# EAGLE design mk6 (EAGLE 8.3.0)
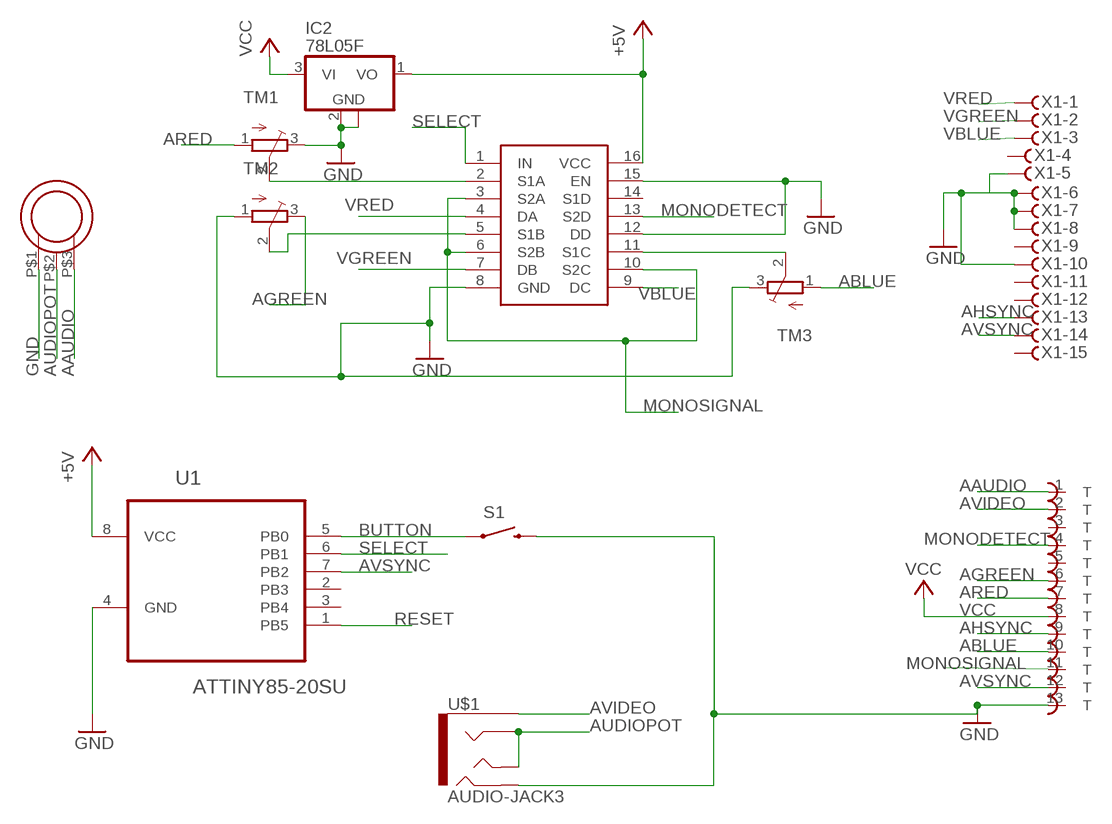
[diagram p0: schematic, sheet 1]

## Parts
ATARIOUT  DIN13T  [ADADS]
IC2  78L05F  [SOT89]
S1  SWITCH-MOMENTARY-2TACTILE-SWITCH-SMD-RIGHT-ANGLE  [TACTILE_SWITCH-SMD-RIGHT-ANGLE]
TM1  TRIMPOTTC33X  [TC33X]
TM2  TRIMPOTTC33X  [TC33X]
TM3  TRIMPOTTC33X  [TC33X]
TS5V330  V330  [SOIC16N]
U1  ATTINY85-20SU  [SOIC127P798X216-8N]
U$1  AUDIO-JACK3  [AUDIO-JACK-TRRS-SMD]
U$2  DB-1001N  [THUMB_POT]
X1  F15HDVS  [HDF15V]

## Nets
+5V: IC2.1(VO) TS5V330.16(VCC) U1.8(VCC)
AAUDIO: ATARIOUT.1 U$2.P$3
ABLUE: ATARIOUT.10 TM3.1(A)
AGREEN: ATARIOUT.6 TM2.3(E)
AHSYNC: ATARIOUT.9 X1.13
ARED: ATARIOUT.7 TM1.1(A)
AUDIOPOT: U$1.RING1 U$1.TIP U$2.P$2
AVIDEO: ATARIOUT.2 U$1.EARTH
AVSYNC: ATARIOUT.12 U1.7(PB2) X1.14
BUTTON: S1.1 U1.5(PB0)
GND: ATARIOUT.13 IC2.2(GND) IC2.2@1(GND) S1.2 TM1.3(E) TM2.1(A) TM3.3(E) TS5V330.8(GND) TS5V330.12(DD) TS5V330.15(EN) U1.4(GND) U$1.RING2 U$2.P$1 X1.5 X1.6 X1.7 X1.8 X1.10
MONODETECT: ATARIOUT.4 TS5V330.13(S2D)
MONOSIGNAL: ATARIOUT.11 TS5V330.3(S2A) TS5V330.6(S2B) TS5V330.10(S2C)
N$1: TM1.2(S) TS5V330.2(S1A)
N$3: TM2.2(S) TS5V330.5(S1B)
N$5: TM3.2(S) TS5V330.11(S1C)
RESET: U1.1(PB5)
SELECT: TS5V330.1(IN) U1.6(PB1)
VBLUE: TS5V330.9(DC) X1.3
VCC: ATARIOUT.8 IC2.3(VI)
VGREEN: TS5V330.7(DB) X1.2
VRED: TS5V330.4(DA) X1.1
Unconnected: ATARIOUT.3 ATARIOUT.5 TS5V330.14(S1D) U1.2(PB3) U1.3(PB4) X1.4 X1.9 X1.11 X1.12 X1.15

## Library data of the parts
ATARIOUT = ube:DIN13
IC2 = linear:78L*: POSITOIV-VOLTAGE REGULATORS Output up to 100 mA Source: Datasheet <http://focus.ti.com/lit/ds/symlink/ua78l05.pdf>
S1 = SparkFun-Electromechanical:SWITCH-MOMENTARY-2: Various NO switches- pushbuttons, reed, etc; PROD_ID: COMP-12265
TM1-TM3 = adafruit:TRIMPOT: SMT trimmer potentiometer part number TC33X http://www.ladyada.net/library/eagle
TS5V330 = ube:V330
U1 = Atmel_By_element14_Batch_1-00:ATTINY85-20SU: 8-bit Microcontroller with In-System Programmable Flash; MPN: ATTINY85-20SU; OC_FARNELL: 1455164; OC_NEWARK: 58M3797; PACKAGE: SOIC-8; SUPPLIER: Atmel
U$1 = SparkFun-Connectors:AUDIO-JACK3: Audio jack - 3.5mm TRRS variety - two rings.; PROD_ID: CONN-10676
U$2 = irbanur_rev1:DB-1001N: Multicomp DB-1001N thumbwheel potentiometer Source: DB Datasheet <http://www.debonelectronics.com/sale-7784350-db-1001n-thumbwheel-potentiometer.html> created by: mochini@2017 <https://www.fiverr.com/mochini77>
X1 = con-subd:F15?S: SUB-D; OC_FARNELL: unknown; OC_NEWARK: unknown

## Net classes
0 default: width 0.254 mm

## Board
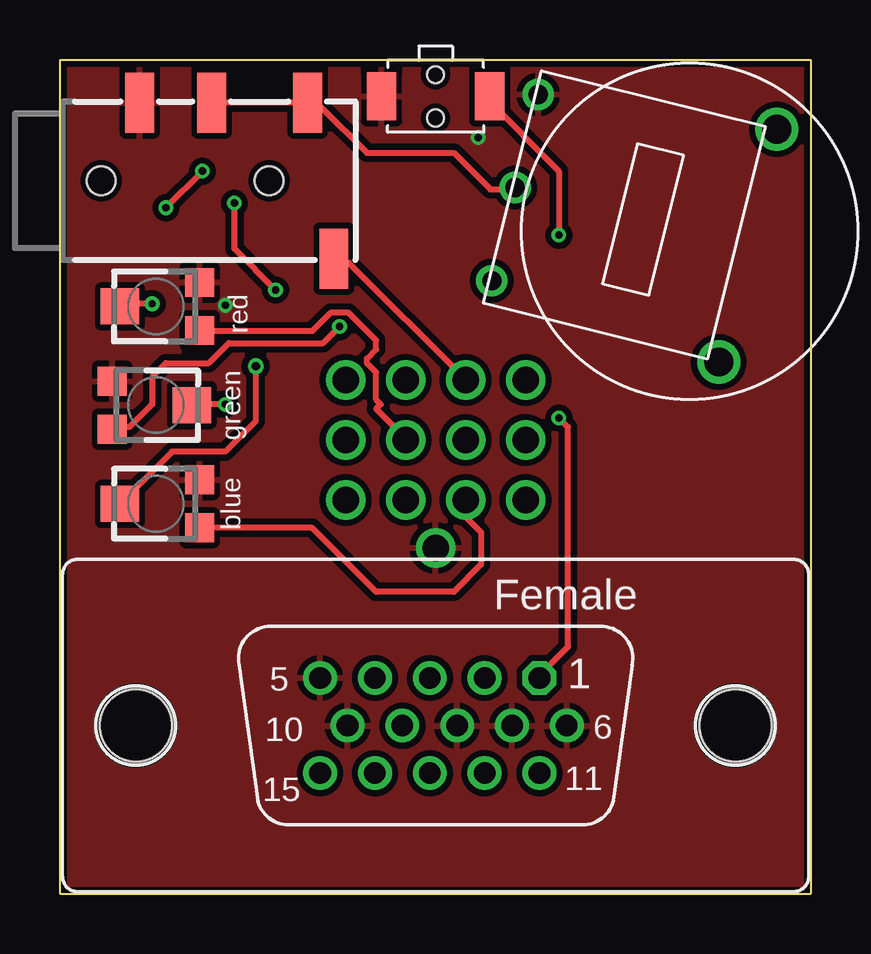
[diagram p1: board, top side]
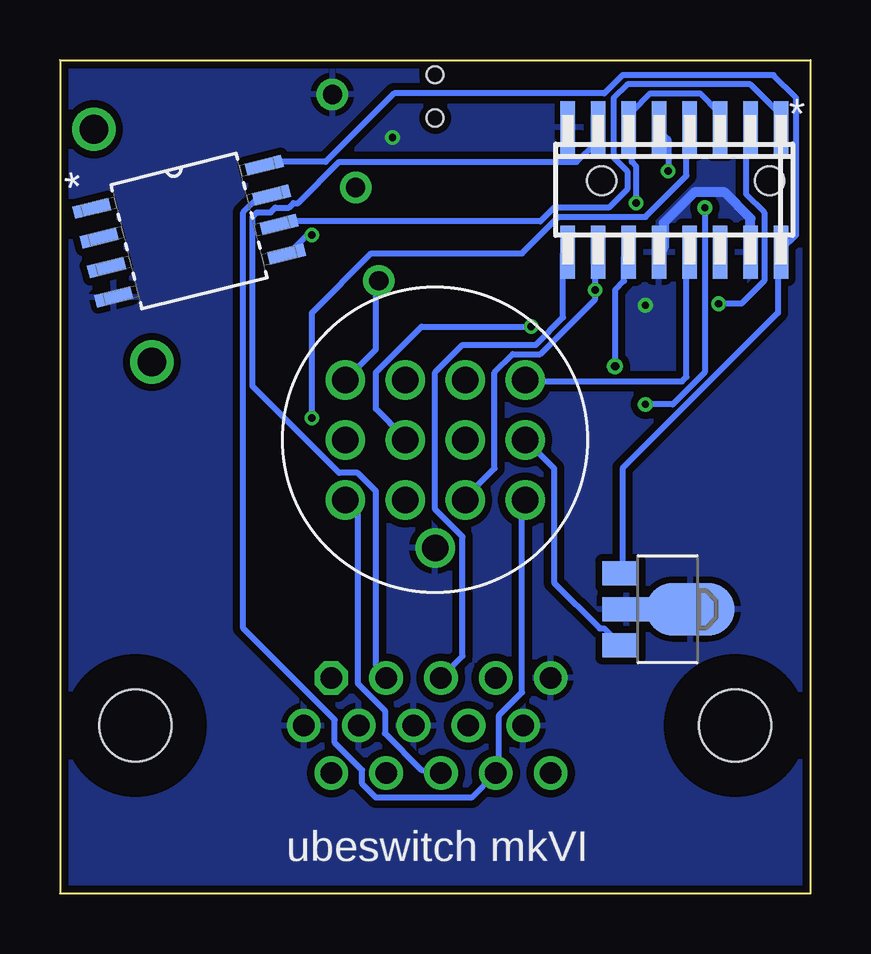
[diagram p2: board, bottom side, seen from below]

Size 31.3 x 34.73 mm. Coordinates in mm from the lower left corner, seen from the top.
Outline: 0,0 31.3,0 31.3,34.73 0,34.73 0,0
Copper layers (1*16): Top 0.035mm / dielectric 1.5mm / Bottom 0.035mm
Design rules "dirt_cheap_dirty_boards.v1": minimum track width 5mil, minimum drill 12mil, track to track 5mil, track to pad 5mil, pad to pad 5mil, via to via 5mil, smd to smd 0mil, copper to edge 10mil, drill to drill 10mil, minimum pad ring 10mil, minimum via ring 6mil, stop-mask expansion 2mil, vias tented up to drill 25mil, thermal gap 10mil

### Footprints (pad centres in the part's own frame; a part is rotated, then mirrored left to right if it is on the bottom)
ADADS = drill 1.1: 1 -3.75,2.5; 2 -1.25,2.5; 3 1.25,2.5; 4 3.75,2.5; 5 -3.75,0; 6 -1.25,0; 7 1.25,0; 8 3.75,0; 9 -3.75,-2.5; 10 -1.25,-2.5; 11 1.25,-2.5; 12 3.75,-2.5; 13 0,-4.5
SOT89 = smd 1 x 1.5: 1 -1.499,-1.981; 3 1.499,-1.981 | smd 1 x 2: 2 0,-1.727 | smd 2.2 x 3.7: 2@1 0,0.94
TACTILE_SWITCH-SMD-RIGHT-ANGLE = smd 1.219 x 2: 1 -2.255,0; 2 2.255,0 | hole 0.7: 0,0.9; 0,-0.9
TC33X = smd 1.2 x 1.2: 1 -1,-1.825; 3 1,-1.825 | smd 1.5 x 1.6: 2 0,1.5
SOIC16N = smd 0.6 x 2.2: 1 -4.445,-2.6; 2 -3.175,-2.6; 3 -1.905,-2.6; 4 -0.635,-2.6; 5 0.635,-2.6; 6 1.905,-2.6; 7 3.175,-2.6; 8 4.445,-2.6; 9 4.445,2.6; 10 3.175,2.6; 11 1.905,2.6; 12 0.635,2.6; 13 -0.635,2.6; 14 -1.905,2.6; 15 -3.175,2.6; 16 -4.445,2.6
SOIC127P798X216-8N = smd 1.549 x 0.533: 1 -3.708,1.905; 2 -3.708,0.635; 3 -3.708,-0.635; 4 -3.708,-1.905; 5 3.708,-1.905; 6 3.708,-0.635; 7 3.708,0.635; 8 3.708,1.905
AUDIO-JACK-TRRS-SMD = smd 1.2 x 2.5: EARTH 11.3,-3.25; RING1 6.2,3.25; RING2 3.2,3.25; TIP 10.2,3.25 | hole 1.2: 1.6,0; 8.6,0
THUMB_POT = drill 0.8: P$1 -4,-7.5; P$2 0,-7.5; P$3 4,-7.5 | drill 1.2: P$4 -5,2.5; P$5 5,2.5
HDF15V = drill 0.9 octagon: 1 4.329,1.98 | drill 0.9: 2 2.043,1.98; 3 -0.243,1.98; 4 -2.529,1.98; 5 -4.815,1.98; 6 5.472,0; 7 3.186,0; 8 0.9,0; 9 -1.386,0; 10 -3.672,0; 11 4.329,-1.98; 12 2.043,-1.98; 13 -0.243,-1.98; 14 -2.529,-1.98; 15 -4.815,-1.98 | hole 3: -12.5,0; 12.5,0

### Placement (x,y rotation side)
ATARIOUT  15.66,18.9 0 bottom
IC2  5.96,11.85 270 bottom
S1  15.66,33.21 180 top
TM1  4,24.46 90 top
TM2  4,20.35 270 top
TM3  4,16.24 90 top
TS5V330  5.69,29.32 180 bottom
U1  25.92,27.6 14 bottom
U$1  0.12,29.7 0 top
U$2  26.25,27.6 256 top
X1  15.66,7 0 top

### Tracks (layer width: path | path; a pad name or v marks a point on that pad's centre or on a via)
+5V
  Bottom 0.254: IC2.1 7.84,13.53 7.84,17.72 1.37,24.19 1.37,26.67 TS5V330.16 1.18,26.86 0.61,27.43 0.61,33.15 1.56,34.1 7.84,34.1 8.61,33.34 17.37,33.34 20.23,30.48 22.7,30.48 U1.8
AAUDIO
  Bottom 0.254: U$2.P$3 18.13,25.53 18.13,22.67 19.27,21.53 ATARIOUT.1
ABLUE
  Top 0.254: TM3.1 10.51,15.24 13.18,12.57 16.42,12.57 17.56,13.72 17.56,15.05 16.99,15.62 16.99,16.38 ATARIOUT.10
AGREEN  (via drill 0.3)
  Top 0.254: TM2.3 2.32,19.43 2.89,19.43 3.84,20.38 3.84,21.53 4.42,22.1 6.2,22.1 7.03,22.93 10.97,22.93 v11.65,23.62
  Bottom 0.254: v11.65,23.62 16.23,23.62 18.13,21.72 18.13,20.19 16.99,19.05 ATARIOUT.6
AHSYNC
  Bottom 0.254: X1.13 15.46,5.14 16.23,5.14 17.75,6.67 17.75,7.62 18.89,8.76 18.89,16 19.27,16.38 ATARIOUT.9
ARED
  Top 0.254: TM1.1 5.94,23.43 10.51,23.43 11.27,24.19 12.04,24.19 13.18,23.05 13.18,22.67 12.8,22.29 12.8,22.1 13.18,21.72 13.18,20.57 13.37,20.38 13.18,20.19 14.32,19.05 ATARIOUT.7
AUDIOPOT
  Top 0.254: U$1.RING1 10.13,32.96 U$1.TIP 10.32,32.77 10.89,32.77 12.8,30.86 16.42,30.86 17.94,29.34 18.89,29.34 U$2.P$2
AVIDEO
  Top 0.254: U$1.EARTH 11.46,26.29 12.04,26.29 16.8,21.53 ATARIOUT.2
AVSYNC
  Bottom 0.254: U1.7 22.51,28.96 23.08,28.96 23.66,28.38 23.66,11.05 19.85,7.24 19.85,6.29 18.7,5.14 18.7,4.57 18.13,4 14.13,4 13.18,4.95 X1.14 12.99,5.14 12.99,7.43 12.04,8.38 12.04,16.38 ATARIOUT.12
BUTTON  (via drill 0.3)
  Top 0.254: v20.8,27.43 20.8,30.1 17.75,33.15 S1.1
  Bottom 0.254: v20.8,27.43 20.99,27.43 21.75,26.67 U1.5
GND  (via drill 0.3)
  Bottom 0.406: TS5V330.15 2.52,28.14 3.59,29.21 4.86,29.21 6.13,27.94 6.13,26.91 TS5V330.12
  other vias: 17.43,31.5 6.89,24.51
  pour Top (isolate 0.254): -0.22,35.56 36.61,35.56 36.61,-1.27 -0.22,-1.27
  pour Bottom (isolate 0.305): -1.49,38.1 36.61,35.56 36.61,-1.27 -0.22,-1.27
MONODETECT
  Bottom 0.254: TS5V330.13 5.18,26.67 5.18,21.53 5.37,21.34 11.84,21.34 ATARIOUT.4
MONOSIGNAL  (via drill 0.3)
  Top 0.254: v7.27,28.77 7.27,26.86 v8.99,25.15
  Bottom 0.254: TS5V330.3 3.84,32 3.84,32.58 4.61,33.34 6.7,33.34 7.46,32.58 7.46,32 TS5V330.6 7.46,31.81 7.46,30.48 7.27,30.29 v7.27,28.77 | TS5V330.10 8.99,26.67 v8.99,25.15 8.99,24.77 11.27,22.48 12.42,22.48 13.18,21.72 13.18,17.72 14.32,16.57 ATARIOUT.11
N$1  (via drill 0.3)
  Top 0.254: v3.84,24.57 2.51,24.57 TM1.2
  Bottom 0.254: v3.84,24.57 2.89,24.57 1.94,25.53 1.94,28.38 2.7,29.15 2.7,31.81 TS5V330.2
N$3  (via drill 0.3)
  Top 0.254: v6.89,20.38 5.56,20.38 TM2.2 | v5.94,30.1 v4.42,28.57
  Bottom 0.254: v6.89,20.38 5.75,20.38 4.42,21.72 v4.42,28.57 | v5.94,30.1 5.94,31.43 6.32,31.81 TS5V330.5
N$5  (via drill 0.35)
  Top 0.254: 2.51,16.38 TM3.2 4.67,18.41 6.89,18.41 8.16,19.68 v8.16,21.97
  Bottom 0.254: 7.46,26.67 TS5V330.11 7.78,26.53 7.78,25.53 8.16,25.15 v8.16,21.97
SELECT
  Bottom 0.254: U1.6 22.13,28 11.27,28 10.7,28.57 8.42,28.57 7.65,29.34 7.65,30.1 8.23,30.67 8.23,33.15 7.65,33.72 2.51,33.72 1.37,32.58 1.37,32 TS5V330.1
VBLUE
  Bottom 0.254: TS5V330.9 10.32,26.67 10.32,24 11.46,22.86 14.51,22.86 15.65,21.72 15.65,16 14.51,14.86 14.51,9.91 15.27,9.14 X1.3
VCC
  Bottom 0.254: IC2.3 8.04,10.48 8.61,11.05 8.8,11.05 10.7,12.95 10.7,17.72 11.84,18.86 ATARIOUT.8
VGREEN
  Bottom 0.254: TS5V330.7 8.99,31.81 8.99,31.24 9.75,30.48 19.66,30.48 21.37,28.77 21.56,28.77 21.75,28.57 22.32,28.57 22.51,28.38 23.08,28.38 23.27,28.19 23.27,21.14 19.66,17.53 18.89,17.53 18.13,16.76 18.13,9.53 17.75,9.14 X1.2
VRED  (via drill 0.3)
  Top 0.254: v20.8,19.81 21.18,19.43 21.18,10.29 20.04,9.14 X1.1
  Bottom 0.254: v20.8,19.81 20.8,24.19 18.32,26.67 12.04,26.67 10.51,28.19 6.89,28.19 5.18,29.91 5.18,31.81 TS5V330.4

### Text on the board
tPlace: red | green | blue
bNames: ubeswitch mkVI